# Altium schematic sheet OBDH_top.SchDoc: FloripaSat / OBDHTTC Subsystem / TOP SCHEMATICS
size A3; SheetNumber: 2; SheetTotal: 11
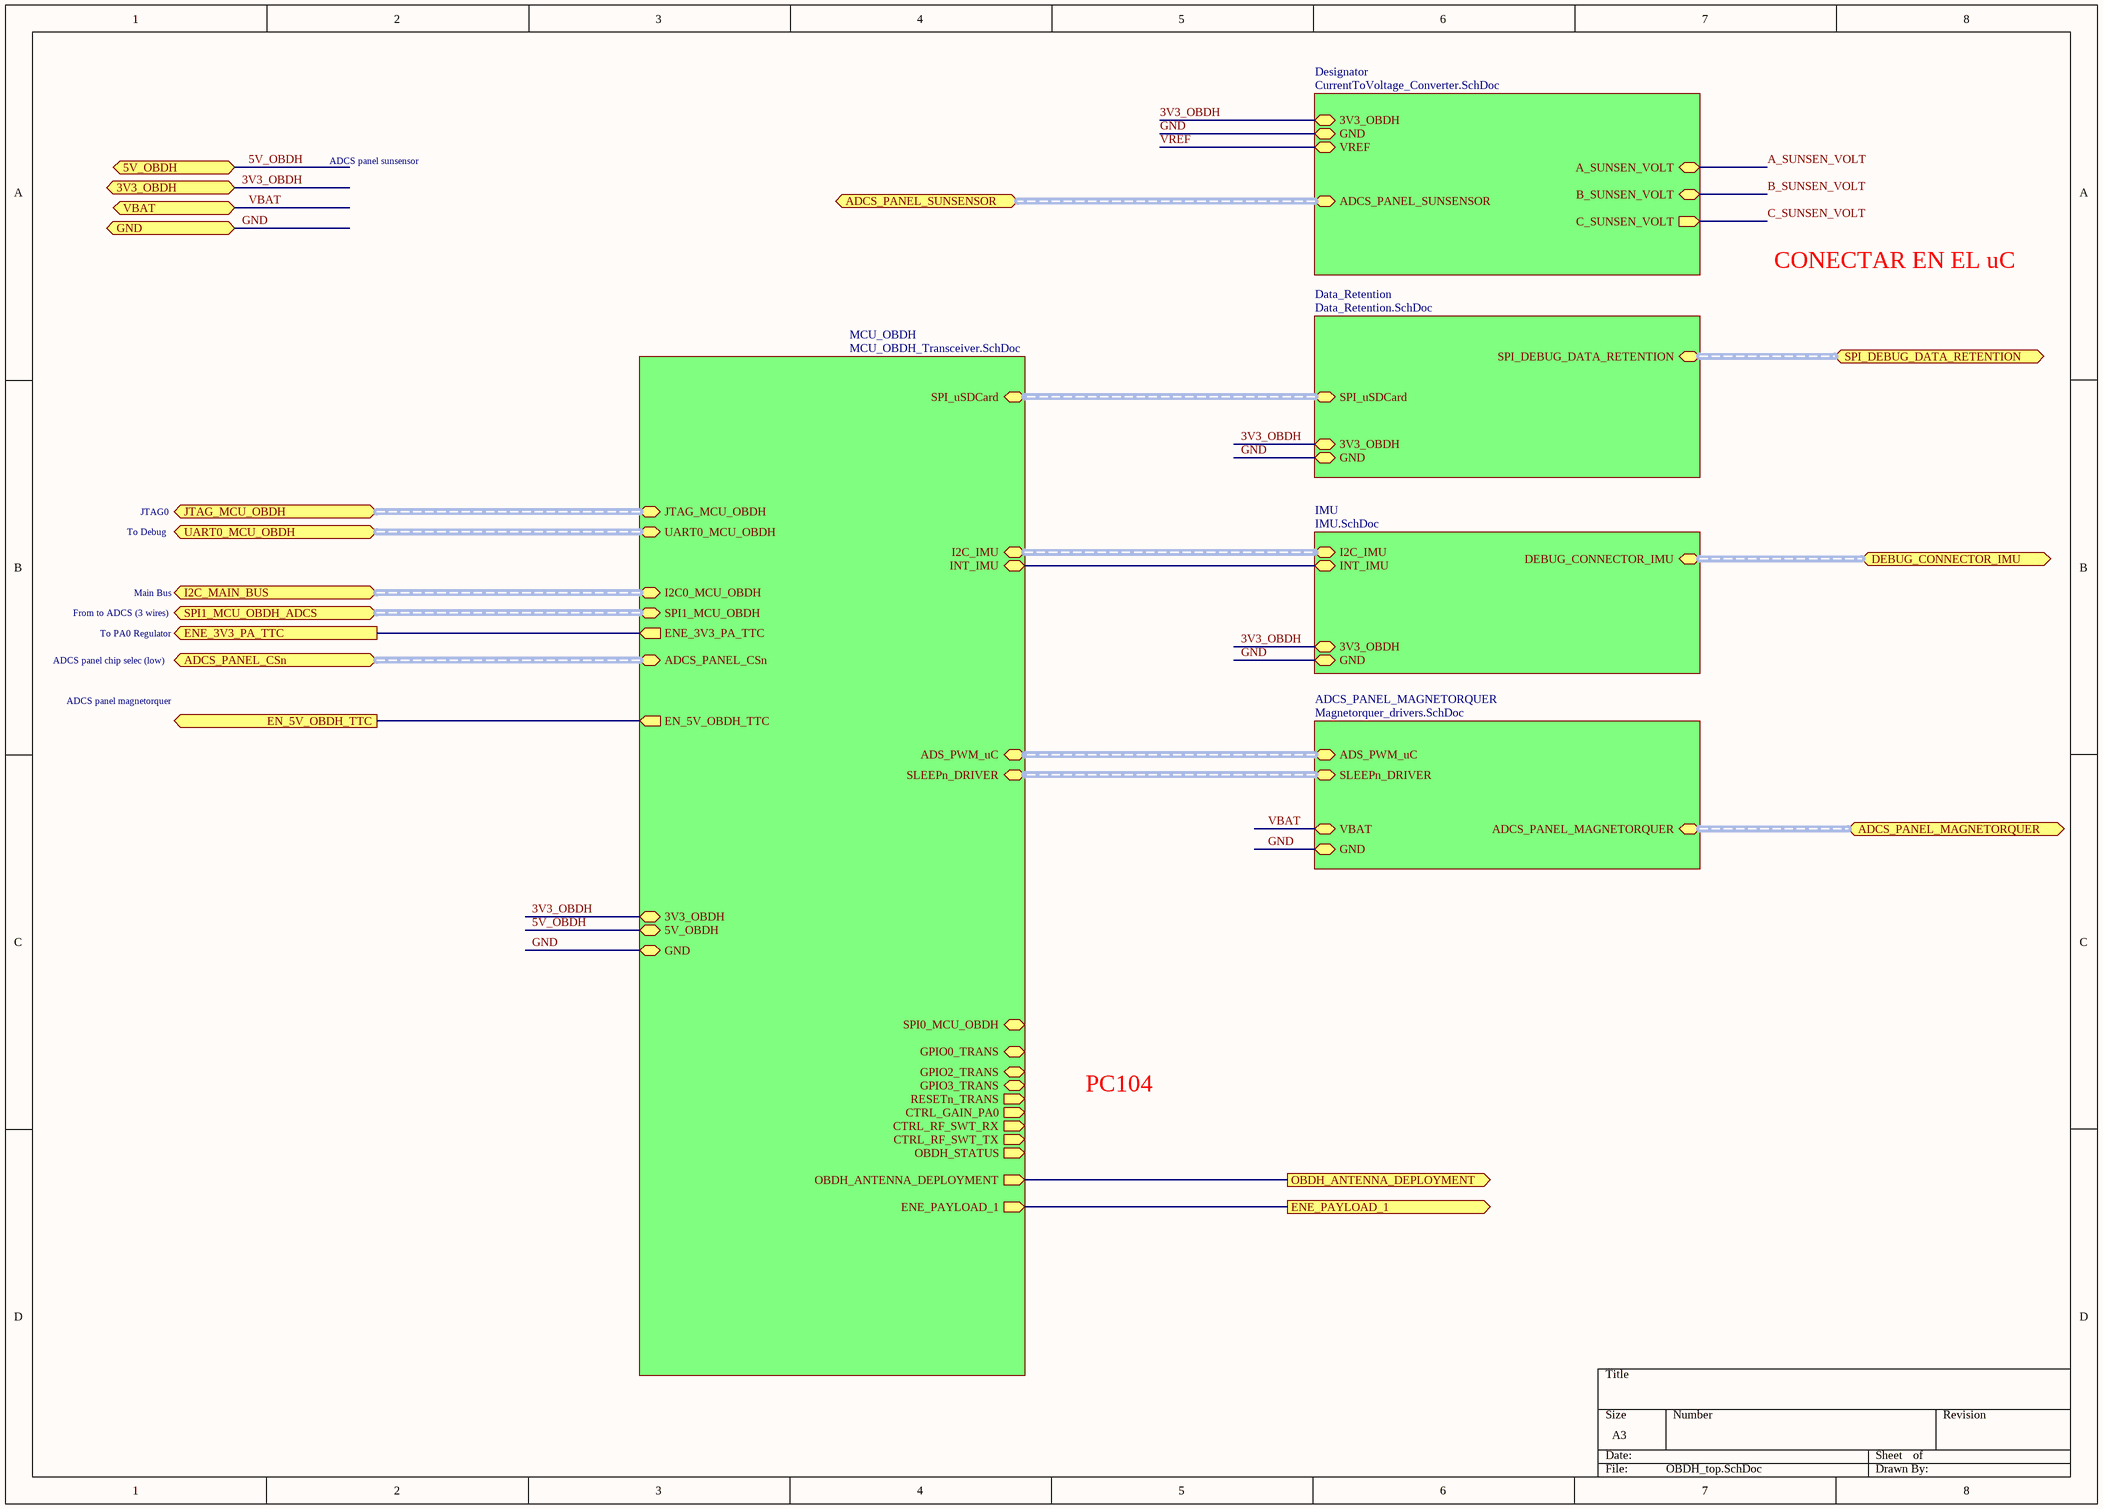
[diagram p0: OBDH_top.SchDoc]

## Sub-sheets
ADCS_PANEL_MAGNETORQUER = Magnetorquer_drivers.SchDoc: ADCS_PANEL_MAGNETORQUER (harness ADCS_Harness_MAGNETORQUER), ADS_PWM_uC (harness ADS_PWM_uC), SLEEPn_DRIVER (harness SLEEPn_DRIVER), VBAT, GND
Data_Retention = Data_Retention.SchDoc: SPI_uSDCard (harness SPI_uSDCard), 3V3_OBDH, GND, SPI_DEBUG_DATA_RETENTION (harness SPI_DEBUG_DATA_RETENTION)
Designator = CurrentToVoltage_Converter.SchDoc: A_SUNSEN_VOLT (bidir), B_SUNSEN_VOLT (bidir), C_SUNSEN_VOLT (out), 3V3_OBDH, GND, VREF, ADCS_PANEL_SUNSENSOR (harness ADCS_Harness_SUNSENSOR)
IMU = IMU.SchDoc: I2C_IMU (harness I2C_IMU), INT_IMU, GND, 3V3_OBDH, DEBUG_CONNECTOR_IMU (harness DEBUG_CONNECTOR_IMU)
MCU_OBDH = MCU_OBDH_Transceiver.SchDoc: SPI0_MCU_OBDH (harness SPI0_Harness_MCU_OBDH), JTAG_MCU_OBDH (harness JTAG_Harness_MCU_OBDH), I2C0_MCU_OBDH (harness I2C0_Harness_MCU_OBDH), UART0_MCU_OBDH (harness UART0_Harness_MCU_OBDH), CTRL_GAIN_PA0 (out), OBDH_STATUS (out), CTRL_RF_SWT_RX (out), CTRL_RF_SWT_TX (out), 3V3_OBDH, GND, ENE_3V3_PA_TTC (out), SPI1_MCU_OBDH (harness SPI1_Harness_MCU_OBDH), ADCS_PANEL_CSn (harness ADCS_Harness_CSn), RESETn_TRANS (out), OBDH_ANTENNA_DEPLOYMENT (out), ENE_PAYLOAD_1 (out), GPIO0_TRANS (bidir), GPIO2_TRANS (bidir), 5V_OBDH, EN_5V_OBDH_TTC (out), GPIO3_TRANS (bidir), ADS_PWM_uC (harness ADS_PWM_uC), SLEEPn_DRIVER (harness SLEEPn_DRIVER), I2C_IMU (harness I2C_IMU), INT_IMU, SPI_uSDCard (harness SPI_USDCard)

## Ports
3V3_OBDH, 5V_OBDH, ADCS_PANEL_CSn (harness ADCS_Harness_CSn), ADCS_PANEL_MAGNETORQUER (harness ADCS_Harness_MAGNETORQUER), ADCS_PANEL_SUNSENSOR (harness ADCS_Harness_SUNSENSOR), DEBUG_CONNECTOR_IMU (harness DEBUG_CONNECTOR_IMU), EN_5V_OBDH_TTC (out), ENE_3V3_PA_TTC (out), ENE_PAYLOAD_1 (out), GND, I2C_MAIN_BUS (harness I2C0_Harness_MCU_OBDH), JTAG_MCU_OBDH (harness JTAG_Harness_MCU_OBDH), OBDH_ANTENNA_DEPLOYMENT (out), SPI1_MCU_OBDH_ADCS (harness SPI1_Harness_MCU_OBDH), SPI_DEBUG_DATA_RETENTION (harness SPI_DEBUG_DATA_RETENTION), UART0_MCU_OBDH (harness UART0_Harness_MCU_OBDH), VBAT

## Nets
3V3_OBDH: port 3V3_OBDH, sheet MCU_OBDH/3V3_OBDH, sheet Designator/3V3_OBDH, sheet Data_Retention/3V3_OBDH, sheet IMU/3V3_OBDH
5V_OBDH: port 5V_OBDH, sheet MCU_OBDH/5V_OBDH
A_SUNSEN_VOLT: sheet Designator/A_SUNSEN_VOLT
B_SUNSEN_VOLT: sheet Designator/B_SUNSEN_VOLT
C_SUNSEN_VOLT: sheet Designator/C_SUNSEN_VOLT
EN_5V_OBDH_TTC: port EN_5V_OBDH_TTC, sheet MCU_OBDH/EN_5V_OBDH_TTC
ENE_3V3_PA_TTC: port ENE_3V3_PA_TTC, sheet MCU_OBDH/ENE_3V3_PA_TTC
ENE_PAYLOAD_1: port ENE_PAYLOAD_1, sheet MCU_OBDH/ENE_PAYLOAD_1
GND: port GND, sheet MCU_OBDH/GND, sheet Designator/GND, sheet Data_Retention/GND, sheet ADCS_PANEL_MAGNETORQUER/GND, sheet IMU/GND
OBDH_ANTENNA_DEPLOYMENT: port OBDH_ANTENNA_DEPLOYMENT, sheet MCU_OBDH/OBDH_ANTENNA_DEPLOYMENT
VBAT: port VBAT, sheet ADCS_PANEL_MAGNETORQUER/VBAT
VREF: sheet Designator/VREF
(unnamed): sheet MCU_OBDH/INT_IMU, sheet IMU/INT_IMU

## Buses and harness runs
harness port ADCS_PANEL_CSn = sheet MCU_OBDH/ADCS_PANEL_CSn
harness port ADCS_PANEL_MAGNETORQUER = sheet ADCS_PANEL_MAGNETORQUER/ADCS_PANEL_MAGNETORQUER
harness port ADCS_PANEL_SUNSENSOR = sheet Designator/ADCS_PANEL_SUNSENSOR
harness port DEBUG_CONNECTOR_IMU = sheet IMU/DEBUG_CONNECTOR_IMU
harness port I2C_MAIN_BUS = sheet MCU_OBDH/I2C0_MCU_OBDH
harness port JTAG_MCU_OBDH = sheet MCU_OBDH/JTAG_MCU_OBDH
harness port SPI1_MCU_OBDH_ADCS = sheet MCU_OBDH/SPI1_MCU_OBDH
harness port SPI_DEBUG_DATA_RETENTION = sheet Data_Retention/SPI_DEBUG_DATA_RETENTION
harness port UART0_MCU_OBDH = sheet MCU_OBDH/UART0_MCU_OBDH
harness sheet ADCS_PANEL_MAGNETORQUER/ADS_PWM_uC = sheet MCU_OBDH/ADS_PWM_uC
harness sheet ADCS_PANEL_MAGNETORQUER/SLEEPn_DRIVER = sheet MCU_OBDH/SLEEPn_DRIVER
harness sheet Data_Retention/SPI_uSDCard = sheet MCU_OBDH/SPI_uSDCard
harness sheet IMU/I2C_IMU = sheet MCU_OBDH/I2C_IMU

## Notes on the sheet
- ADCS panel sunsensor
- CONECTAR EN EL uC
- JTAG0
- To Debug
- Main Bus
- From to ADCS (3 wires)
- To PA0 Regulator
- ADCS panel chip selec (low)
- ADCS panel magnetorquer
- PC104